# Altium schematic sheet Sheet5.SchDoc
size A4; Organization: Altium Limited; Address1: L3, 12a Rodborough Rd; Address2: Frenchs Forest; Address3: NSW; Address4: Australia 2086
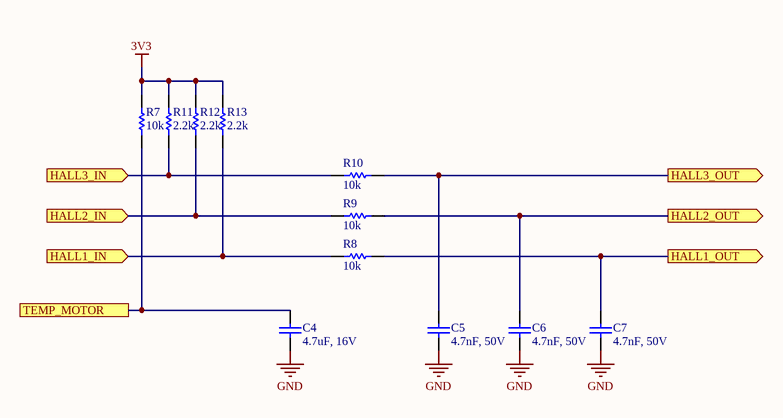
[diagram p0: Sheet5.SchDoc]

## Parts
C4  value 4.7uF, 16V  [SMD-0603 Capacitor]  (hidden comment: CAP)
C5  value 4.7nF, 50V  [SMD-0603 Capacitor]  (hidden comment: CAP)
C6  value 4.7nF, 50V  [SMD-0603 Capacitor]  (hidden comment: CAP)
C7  value 4.7nF, 50V  [SMD-0603 Capacitor]  (hidden comment: CAP)
R7  10k  [SMD-0603 Resistor]
R8  10k  [SMD-0603 Resistor]
R9  10k  [SMD-0603 Resistor]
R10  10k  [SMD-0603 Resistor]
R11  2.2k  [SMD-0603 Resistor]
R12  2.2k  [SMD-0603 Resistor]
R13  2.2k  [SMD-0603 Resistor]

## Ports
HALL1_IN (in), HALL1_OUT (out), HALL2_IN (in), HALL2_OUT (out), HALL3_IN (in), HALL3_OUT (out), TEMP_MOTOR

## Nets
3V3: R7.2 R11.2 R12.2 R13.2
GND: C4.1 C5.1 C6.1 C7.1
HALL1_IN: R8.2 R13.1 ; port HALL1_IN
HALL1_OUT: C7.2 R8.1 ; port HALL1_OUT
HALL2_IN: R9.2 R12.1 ; port HALL2_IN
HALL2_OUT: C6.2 R9.1 ; port HALL2_OUT
HALL3_IN: R10.2 R11.1 ; port HALL3_IN
HALL3_OUT: C5.2 R10.1 ; port HALL3_OUT
TEMP_MOTOR: C4.2 R7.1 ; port TEMP_MOTOR

## Notes on the sheet
- Title
- Size:
- Date:
- A4
- Number:
- Time:
- Revision:
- Sheet
- of
- File:

## Library data of the parts
C4 = 25: CAP 4.7u, 16V, 0603; Manufacturer Part Number: C1608X6S1C475K080AC; Manufacturer: TDK Corporation; ID: 25; Place (YES/NO): YES
C5-C7 = 1: CAP 4.7n, 50V, 0603; Manufacturer Part Number: GRM39X472J50D; Manufacturer: Murata Electronics North America; ID: 1; Place (YES/NO): YES
R7-R10 = 5: R 10k, 0603; Manufacturer Part Number: RK73H1JTTD1002F; Manufacturer: KOA Speer; ID: 5; Place (YES/NO): YES; Value: 10k
R11-R13 = 3: R 2.2k, 0603; Manufacturer Part Number: RK73H1JTTD2201F; Manufacturer: KOA Speer; ID: 3; Place (YES/NO): YES; Value: 2.2k